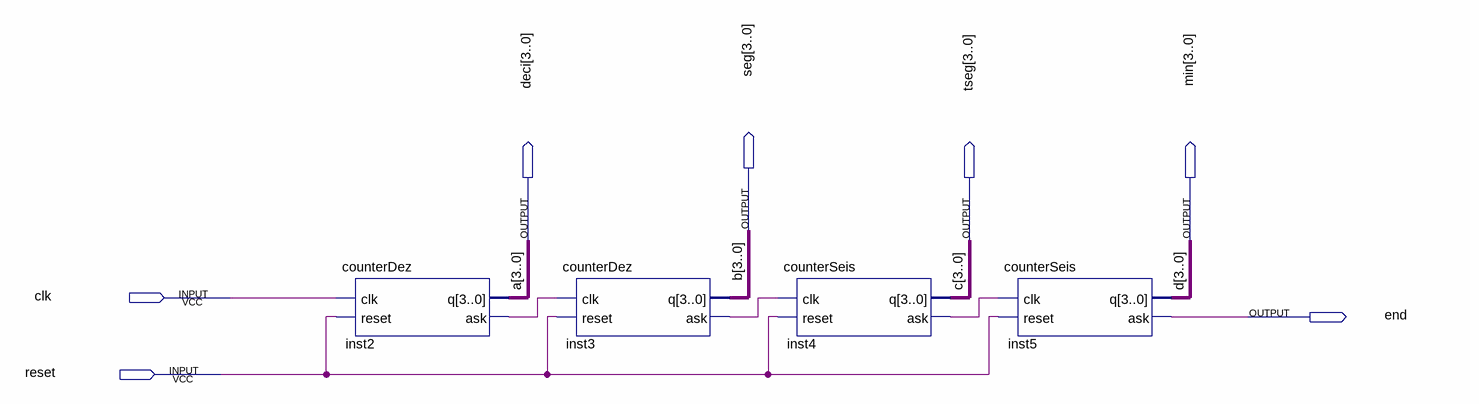
[diagram p0: schematic sheet]
// Quartus schematic timer.bdf as structural Verilog: 4 symbols, 7 pins
module timer (
  input  clk,
  input  reset,
  output [3:0] seg,
  output [3:0] deci,
  output [3:0] tseg,
  output [3:0] min,
  output \end 
);

  wire inst2_ask, inst3_ask, inst4_ask;

  counterDez inst2 (.clk(clk), .reset(reset), .q(deci), .ask(inst2_ask));
  counterDez inst3 (.clk(inst2_ask), .reset(reset), .q(seg), .ask(inst3_ask));
  counterSeis inst4 (.clk(inst3_ask), .reset(reset), .q(tseg), .ask(inst4_ask));
  counterSeis inst5 (.clk(inst4_ask), .reset(reset), .q(min), .ask(\end ));

  // Other names for the same wires on the sheet: a[3:0] = deci; b[3:0] = seg; c[3:0] = tseg; d[3:0] = min
endmodule
